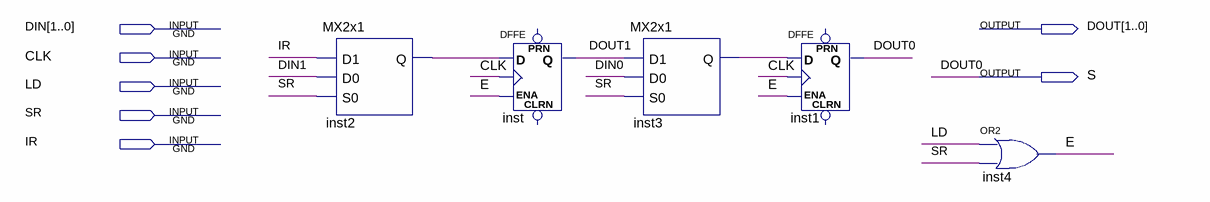
[diagram p0: schematic sheet]
// Quartus schematic REG2_LD_SR.bdf as structural Verilog: 5 symbols, 7 pins
module REG2_LD_SR (
  input  [1:0] DIN,
  input  CLK,
  input  LD,
  input  SR,
  input  IR,
  output [1:0] DOUT,
  output S
);

  wire E, inst2_q, inst3_q;

  MX2x1 inst2 (.D1(IR), .D0(DIN[1]), .S0(SR), .Q(inst2_q));
  DFFE inst (.D(inst2_q), .CLK(CLK), .ENA(E), .Q(DOUT[1]));  // open: PRN, CLRN
  MX2x1 inst3 (.D1(DOUT[1]), .D0(DIN[0]), .S0(SR), .Q(inst3_q));
  DFFE inst1 (.D(inst3_q), .CLK(CLK), .ENA(E), .Q(DOUT[0]));  // open: PRN, CLRN
  or inst4 (E, LD, SR);

  assign S = DOUT[0];
endmodule
